# EAGLE schematic alarm (EAGLE 9.5.2)
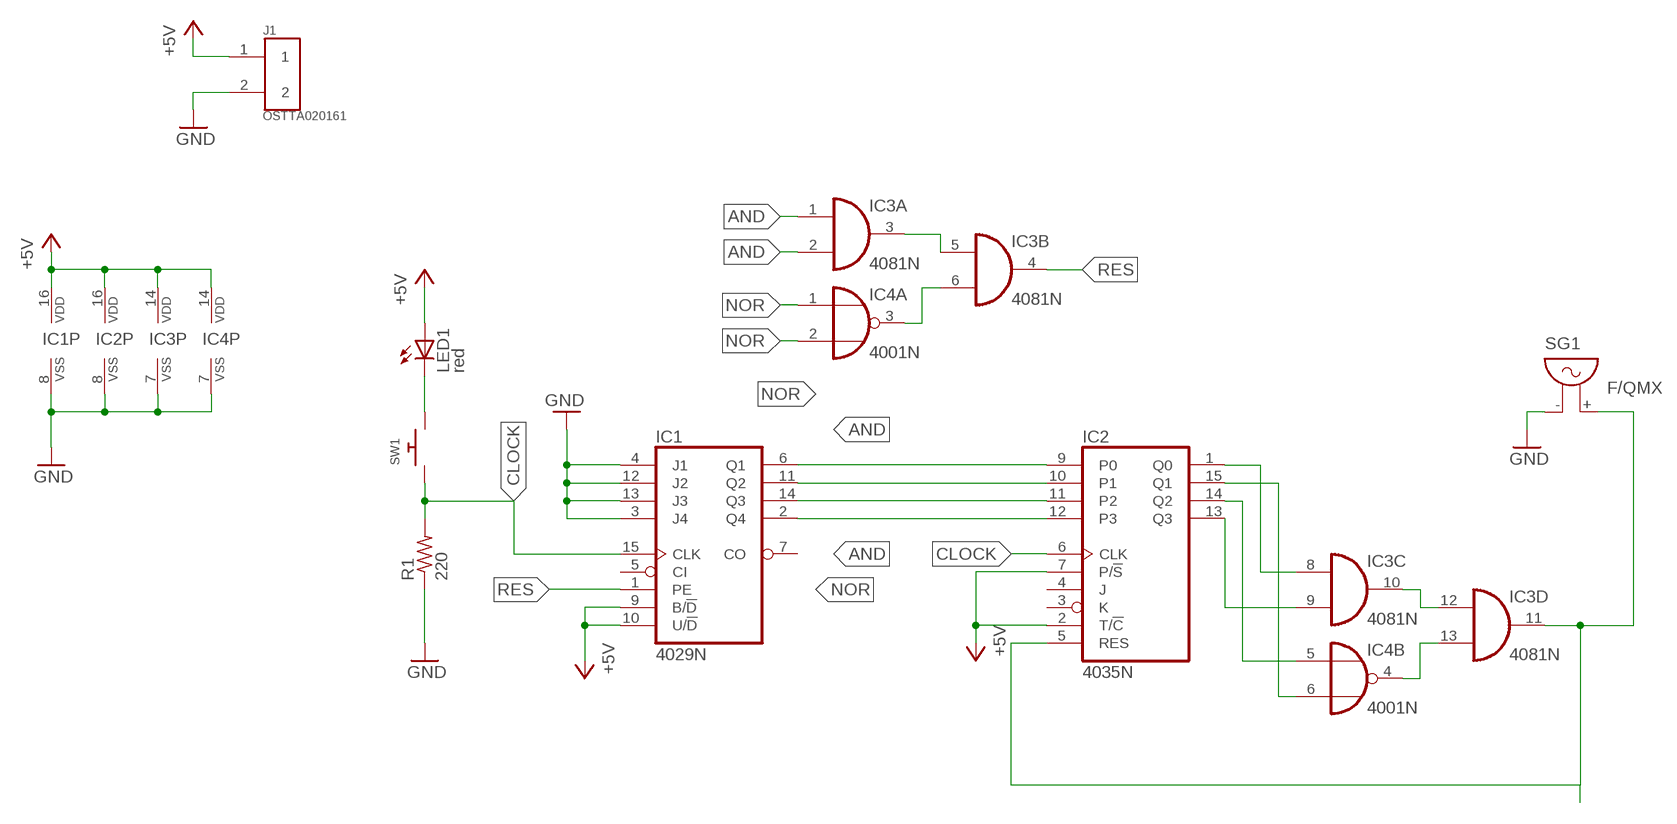
[diagram p0: schematic, sheet 1]

## Parts
IC1  4029N  [DIL16]
IC2  4035N  [DIL16]
IC3  4081N  [DIL14]
IC4  4001N  [DIL14]
J1  OSTTA020161  [OST_OSTTA020161]
LED1  red  LED3MM  [LED3MM]
R1  220  R-US_0204/2V  [0204V]
SG1  F/QMX  [F/QMX]
SW1  SWITCH_PUSHBUTTONEVQ-PE  [TACT_PANA-EVQ]

## Nets
+5V: IC1.9(B/!D) IC1.10(U/!D) IC1.16(VDD) IC2.2(T/!C) IC2.7(P/!S) IC2.16(VDD) IC3.14(P:VDD) IC4.14(P:VDD) J1.1 LED1.A
AND: IC1.2(Q4) IC1.11(Q2) IC2.10(P1) IC2.12(P3) IC3.1(A:I0) IC3.2(A:I1)
CLOCK: IC1.15(CLK) IC2.6(CLK) R1.2 SW1.P$1
GND: IC1.3(J4) IC1.4(J1) IC1.8(VSS) IC1.12(J2) IC1.13(J3) IC2.8(VSS) IC3.7(P:VSS) IC4.7(P:VSS) J1.2 R1.1 SG1.-
N$1: LED1.K(C) SW1.P$2
N$2: IC3.3(A:O) IC3.5(B:I0)
N$3: IC3.6(B:I1) IC4.3(A:O)
N$4: IC2.15(Q1) IC4.6(B:I1)
N$5: IC3.10(C:O) IC3.12(D:I0)
N$6: IC2.1(Q0) IC3.8(C:I0)
N$7: IC2.13(Q3) IC3.9(C:I1)
N$8: IC2.14(Q2) IC4.5(B:I0)
N$9: IC3.13(D:I1) IC4.4(B:O)
N$10: IC2.5(RES) IC3.11(D:O) SG1.+
NOR: IC1.6(Q1) IC1.14(Q3) IC2.9(P0) IC2.11(P2) IC4.1(A:I0) IC4.2(A:I1)
RES: IC1.1(PE) IC3.4(B:O)
Unconnected: IC1.5(CI) IC1.7(CO) IC2.3(K) IC2.4(J) IC4.8(C:I0) IC4.9(C:I1) IC4.10(C:O) IC4.11(D:O) IC4.12(D:I0) IC4.13(D:I1)

## Library data of the parts
IC1 = 40xx:4029: Binary/decimal up/down COUNTER
IC2 = 40xx:4035: 4-bit parallel in/out SHIFT REGISTER
IC3 = 40xx:4081: Quad 2-input AND
IC4 = 40xx:4001: Quad 2-input NOR
J1 = OSTTA020161:OSTTA020161: Connector Terminal Blocks 2 Position 5mm Solder Straight Thru-Hole 16A Check prices <https://pricing.snapeda.com/parts/OSTTA020161/On%20Shore%20Technology%20Inc./view-part?ref=eda>; AVAILABILITY: Warning; DESCRIPTION: 2 Position Wire to Board Terminal Block Horizontal with Board 0.197 (5.00mm) Through Hole; MF: On Shore Technology Inc.; MP: OSTTA020161; PACKAGE: None; PRICE: None; PURCHASE-URL: https://pricing.snapeda.com/search/part/OSTTA020161/?ref=eda
LED1 = adafruit:LED: LED OSRAM: - CHIPLED LG R971, LG N971, LY N971, LG Q971, LY Q971, LO R971, LY R971 LH N974, LH R974 LS Q976, LO Q976, LY Q976 LO Q996 - Hyper CHIPLED LW Q18S LB Q993, LB Q99A, LB R99A - SideLED LS A670, LO A670, LY A670, LG A670, LP A670 LB A673, LV A673, LT A673, LW A673 LH A674 LY A675 LS A676, LA A676, LO A676, LY A676, LW A676 LS A679, LY A679, LG A679 - Hyper Micro SIDELED® LS Y876, LA Y876, LO Y876, LY Y876 LT Y87S - SmartLED LW L88C, LW L88S LB L89C, LB L89S, LG L890 LS L89K, LO L89K, LY L89K LS L896, LA L896, LO L896, LY L896 - TOPLED LS T670, LO T670, LY T670, LG T670, LP T670 LSG T670, LSP T670, LSY T670, LOP T670, LYG T670 LG T671, LOG T671, LSG T671 LB T673, LV T673, LT T673, LW T673 LH T674 LS T676, LA T676, LO T676, LY T676, LB T676, LH T676, LSB T676, LW T676 LB T67C, LV T67C, LT T67C, LS T67K, LO T67K, LY T67K, LW E67C LS E67B, LA E67B, LO E67B, LY E67B, LB E67C, LV E67C, LT E67C LW T67C LS T679, LY T679, LG T679 LS T770, LO T770, LY T770, LG T770, LP T770 LB T773, LV T773, LT T773, LW T773 LH T774 LS E675, LA E675, LY E675, LS T675 LS T776, LA T776, LO T776, LY T776, LB T776 LHGB T686 LT T68C, LB T68C - Hyper Mini TOPLED® LB M676 - Mini TOPLED Santana® LG M470 LS M47K, LO M47K, LY M47K Source: http://www.osram.convergy.de/
R1 = adafruit:R-US_: RESISTOR, American symbol
SG1 = buzzer:F/QMX: BUZZER Source: Buerklin; OC_FARNELL: unknown; OC_NEWARK: unknown
SW1 = adafruit:SWITCH_PUSHBUTTON: Buttons SOFTTOUCHSMD_SJ - Soft touch temporary push button (Super Junk Akihabara) Compatible with SKPMANE010 [Mouser: 688-SKPMAN] C&K_KSS = Digikey: KSS221GLFS